# Altium schematic sheet TK525_HVDC.SchDoc: TK525 HVDC
size A3; Author: Øystein Smith; Organization: Omega Verksted; DocumentNumber: 15; Revision: 0; SheetNumber: 15; SheetTotal: 20
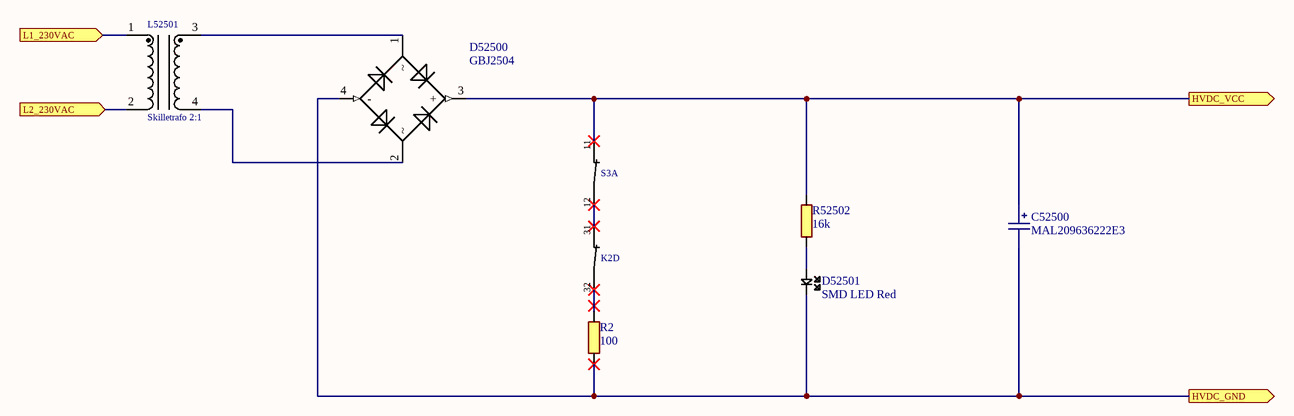
[diagram p0: TK525_HVDC.SchDoc]

## Parts
C52500  MAL209636222E3
D52500  GBJ2504
D52501  SMD LED Red  [I_LEDC0603(1608)_N]
K2  Kontaktor  (value not drawn)  (part D of 6)
L52501  Skilletrafo 2:1
R2  100  [RESA_0.25W]
R52502  16k  [RESA_0.25W]
S3  Automasjonsbryter  (value not drawn)  (part A of 10)

## Ports
HVDC_GND (out), HVDC_VCC (out), L1_230VAC (in), L2_230VAC (in)

## Nets
HVDC_GND: C52500.1 D52500.4(-) D52501.2 R2.1 ; port HVDC_GND
HVDC_VCC: C52500.2 D52500.3(+) R52502.2 S3.11 ; port HVDC_VCC
L1_230VAC: L52501.1 ; port L1_230VAC
L2_230VAC: L52501.2 ; port L2_230VAC
NetD52500_1: D52500.1 L52501.3
NetD52500_2: D52500.2 L52501.4
NetD52501_1: D52501.1 R52502.1
NetK2_31: K2.31 S3.12
NetK2_32: K2.32 R2.2

## Notes on the sheet
- Size:
- Date:
- Title:
- A3
- Revision:
- Sheet
- of
- Author:
- File:

## Library data of the parts
C52500 = 3185: CAP, ALU ELEC, 2200UF, 400V; symbol_opprettet_av: 815; leverandor_varenr: 2342176; pris: 340; nokkelord: Capacitor, Kondensator; pakketype: TH; produsent: Vishay; leverandor: Farnell; id: 3185; navn: MAL209636222E3; symbol_opprettet: 28.06.2014 15:26:13
D52500 = 1629: Likeretterbro; symbol_opprettet_av: 815; pris: 15; pakketype: TH; id: 1629; beskrivelse: diodebro/Likeretterbro 400V 25A; navn: GBJ2504; symbol_opprettet: 09.06.2015 22:09:39
D52501 = 2209: rad: 0; rom: OV; lager_type: Fremlager; dybde: 2; hylle: 13; antall: 50; pakke_opprettet_av: 815; leverandor_varenr: 8554641; pris: 1; pakketype: 0603; produsent: Avago; leverandor: Farnell; id: 2209; navn: SMD LED Red; kolonne: 0; pakke_opprettet: 06.07.2014 18:55:44; symbol_opprettet_av: 815; symbol_opprettet: 06.07.2014 18:59:47; nokkelord: SMD; beskrivelse: SMD
K2 = 3181: Industriellt rele; symbol_opprettet_av: 815; pris: 50; id: 3181; navn: Kontaktor; symbol_opprettet: 04.07.2015 12:23:41; nokkelord: Contactor; pakketype: -
L52501 = 3643: Skilletrafo Ringkjerne; rad: 4; rom: OV; lager_type: Fremlager; dybde: 0; hylle: 2; antall: 40; pakke_opprettet_av: 809; symbol_opprettet_av: 815; pris: 500; nokkelord: Trafo, transformer; produsent: Radiocrafts; id: 3643; navn: Skilletrafo 2:1; kolonne: 4; pakke_opprettet: 21.06.2014 17:19:32; symbol_opprettet: 30.04.2016 00:07:18; pakketype: -
R2 = 2783: 0.25W 1% Generic resistor; id: 2783; rad: 3; rom: OV; lager_type: Fremlager; dybde: 0; hylle: 8; pakke_opprettet_av: 815; symbol_opprettet_av: oystesm; nokkelord: Motstand, Resistor; pakketype: 92; antall: 100; kolonne: 0; pakke_opprettet: 28.06.2014 17:13:33; symbol_opprettet: 08.07.2014 21:16:33; navn: 100; pris: 0
R52502 = 2836: 0.25W 1% Generic resistor; id: 2836; rad: 7; rom: OV; lager_type: Fremlager; dybde: 1; hylle: 8; antall: 100; pakke_opprettet_av: 815; symbol_opprettet_av: oystesm; pris: 0; nokkelord: Motstand, Resistor; pakketype: 92; kolonne: 1; pakke_opprettet: 28.06.2014 17:13:33; symbol_opprettet: 08.07.2014 21:16:33; navn: 16k
S3 = 3182: Kraftig; symbol_opprettet_av: 815; pris: 100; id: 3182; navn: Automasjonsbryter; symbol_opprettet: 05.07.2015 13:10:20; pakketype: -